# EasyEDA Pro project RP2350.epro

# Schematic RP2350
Board Name: RP2350; Create Date: 2025-02-19; Page Name: RP2350; Project Name: ESP32 - RP2350; Schematic Name: RP2350; Update Date: 2025-02-19; Company: EasyEDA.com; Drawn: David Knell; Page Size: A4; Version: V1.0
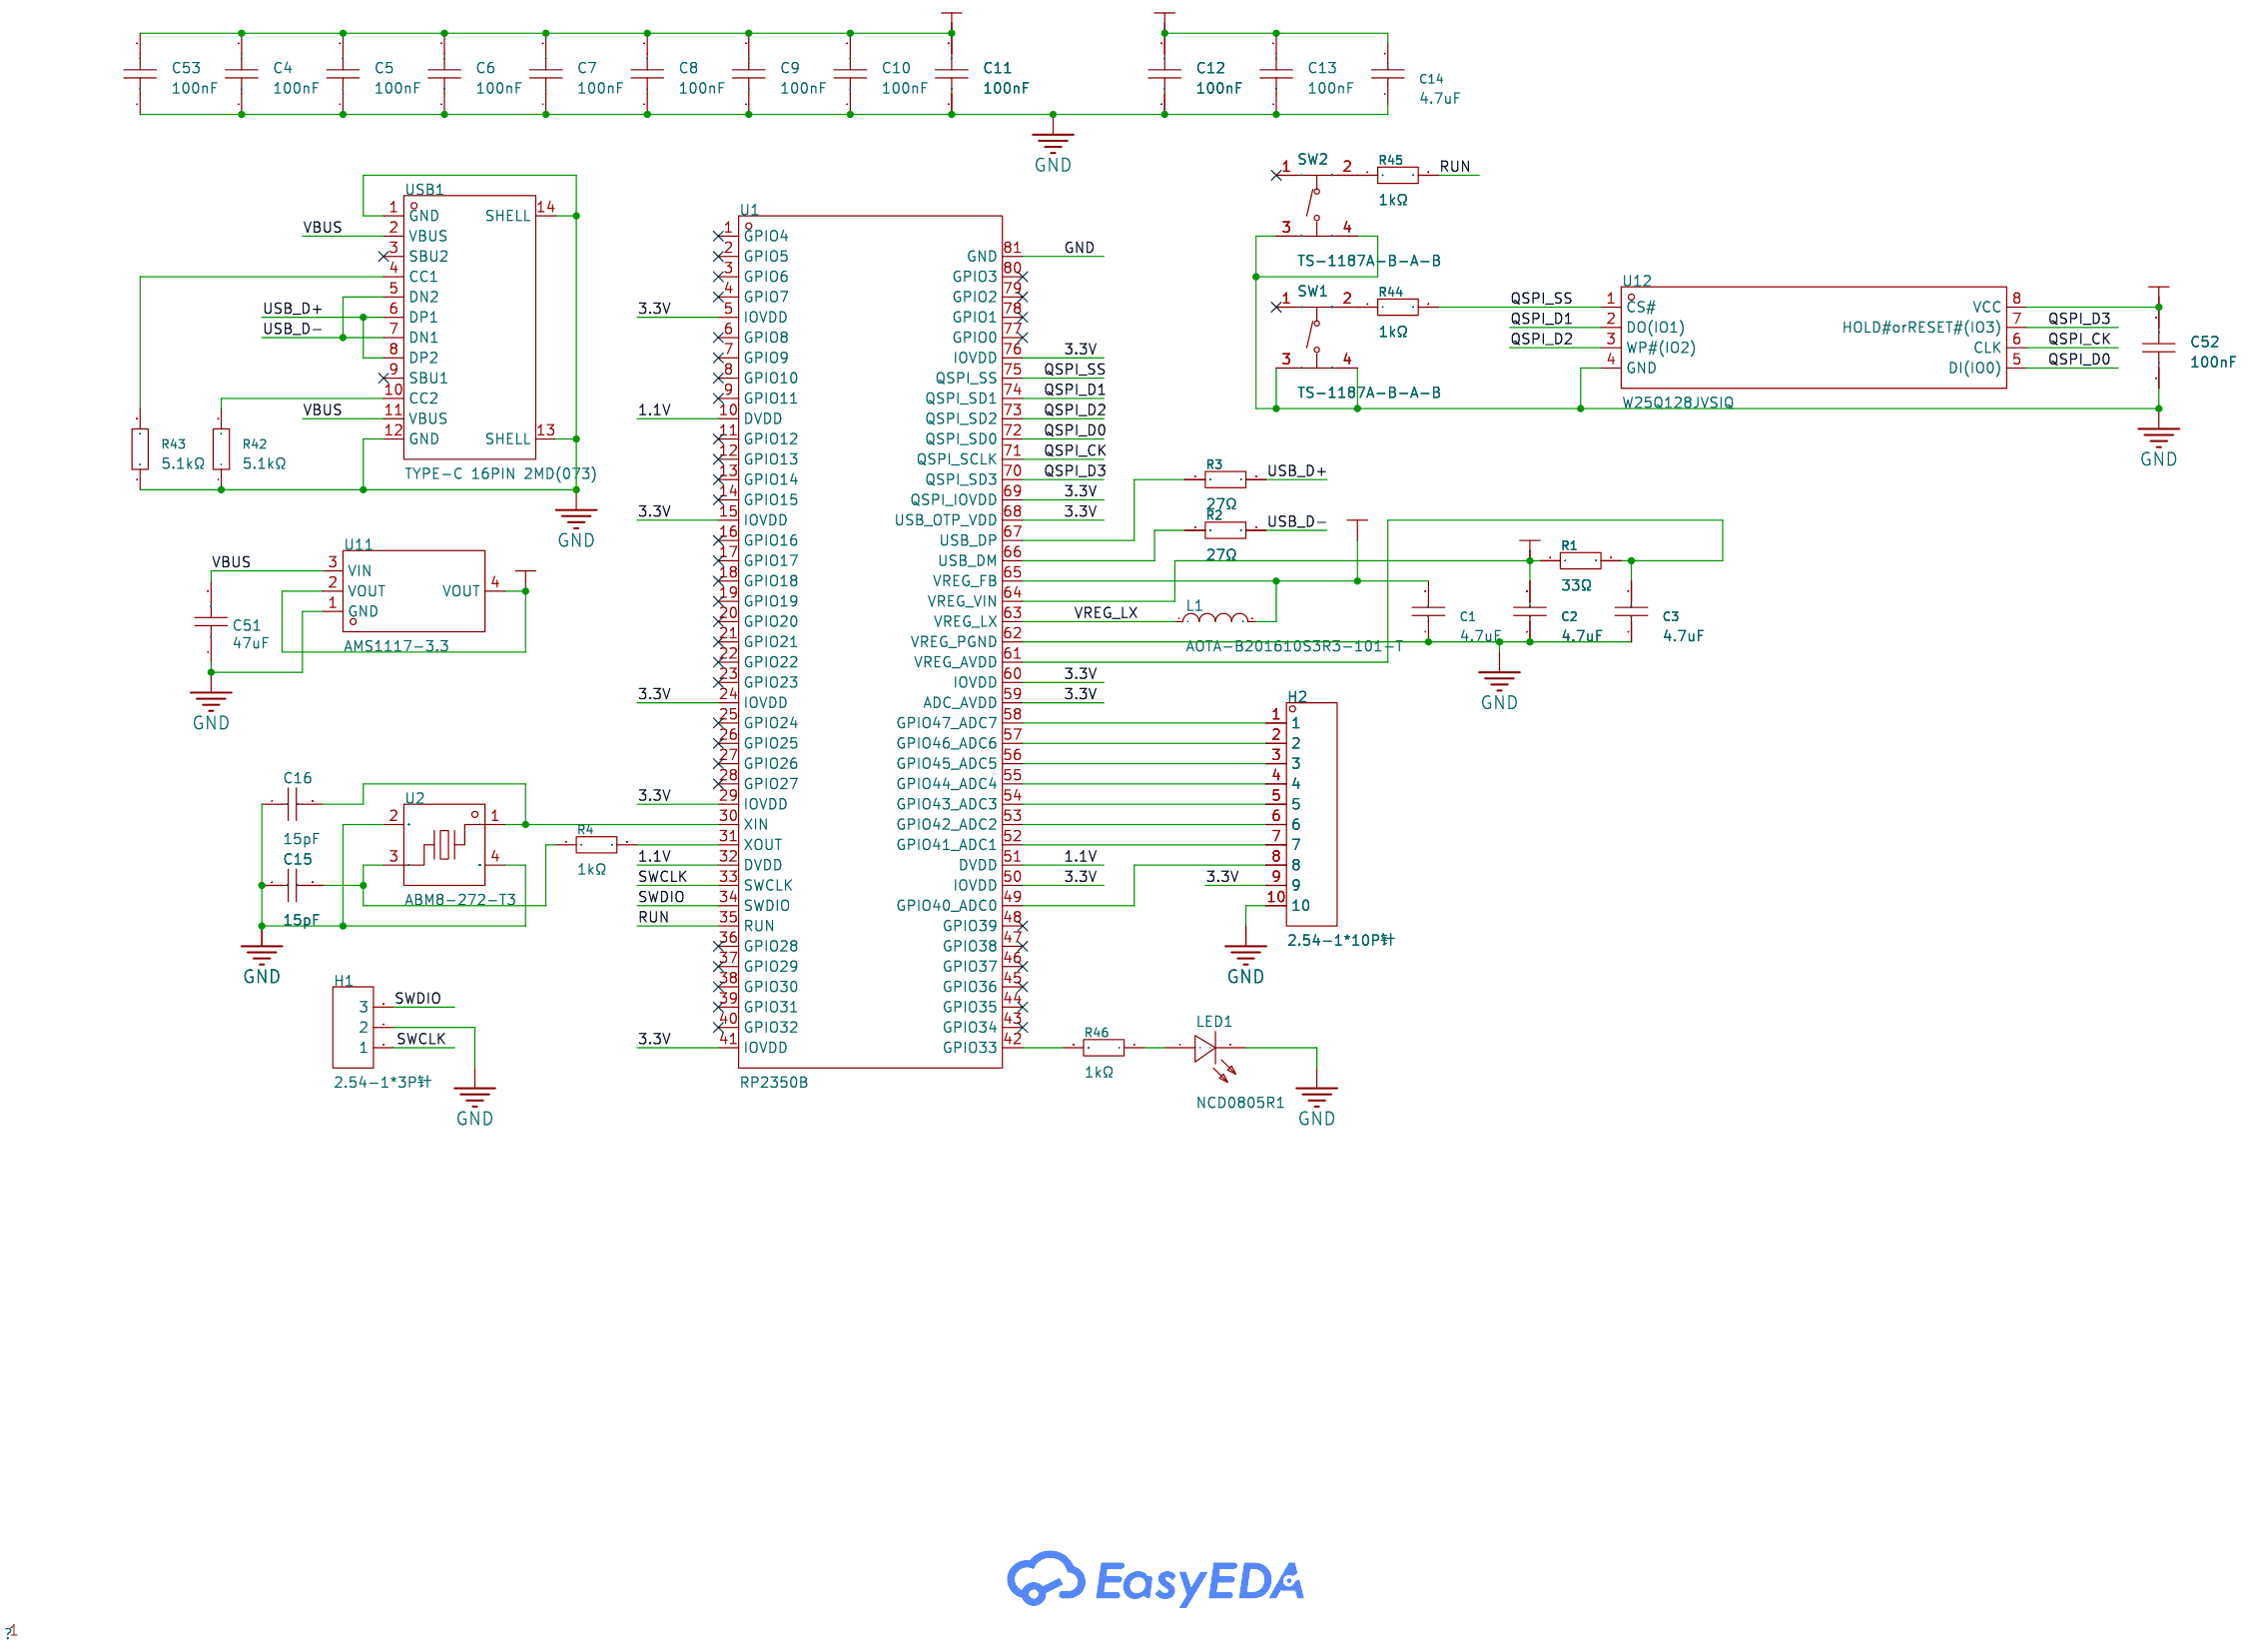
[diagram p0: schematic sheet]

## Parts
C1  4.7uF  [0402-MIN]
C2  4.7uF  [0402-MIN]
C3  4.7uF  [0402-MIN]
C4  100nF  [0402-MIN]
C5  100nF  [0402-MIN]
C6  100nF  [0402-MIN]
C7  100nF  [0402-MIN]
C8  100nF  [0402-MIN]
C9  100nF  [0402-MIN]
C10  100nF  [0402-MIN]
C11  100nF  [0402-MIN]
C12  100nF  [0402-MIN]
C13  100nF  [0402-MIN]
C14  4.7uF  [0402-MIN]
C15  15pF  [C0402]
C16  15pF  [C0402]
C51  47uF  [C1206]
C52  100nF  [0402-MIN]
C53  100nF  [0402-MIN]
H1  2.54-1*3P针  [HDR-TH_3P-P2.54-V-M-1]
H2  2.54-1*10P针  [HDR-TH_10P-P2.54-V-M-1]
L1  AOTA-B201610S3R3-101-T  [IND-SMD_L2.0-W1.6_AOTA-B201610S3R3-101-T]
LED1  NCD0805R1  [LED0805-R-RD]
R1  33Ω  [0402-MIN]
R2  27Ω  [R0402]
R3  27Ω  [R0402]
R4  1kΩ  [R0402]
R42  5.1kΩ  [R0402]
R43  5.1kΩ  [R0402]
R44  1kΩ  [R0402]
R45  1kΩ  [R0402]
R46  1kΩ  [R0402]
SW1  TS-1187A-B-A-B  [SW-SMD_4P-L5.1-W5.1-P3.70-LS6.5-TL_H1.5]
SW2  TS-1187A-B-A-B  [SW-SMD_4P-L5.1-W5.1-P3.70-LS6.5-TL_H1.5]
U1  RP2350B  [QFN-80_L10.0-W10.0-P0.40-TL-EP3.4]
U2  ABM8-272-T3  [CRYSTAL-SMD_4P-L3.2-W2.5-BL]
U11  AMS1117-3.3  [SOT-223-3_L6.5-W3.4-P2.30-LS7.0-BR]
U12  W25Q128JVSIQ  [SOIC-8_L5.3-W5.3-P1.27-LS8.0-BL]
USB1  TYPE-C 16PIN 2MD(073)  [USB-C-SMD_TYPE-C-6PIN-2MD-073]

## Library data of the parts
C1-C3 C14 = CL05A475MP5NRNC: Capacitance: Tolerance:±20% Tolerance:±20% Voltage Rated: Temperature Coefficient:; LCSC Part Name: 4.7uF ±20% 10V; Supplier Part: C23733; Manufacturer: SAMSUNG(三星); Supplier Footprint: 0402; JLCPCB Part Class: Basic Part; Datasheet: https://atta.szlcsc.com/upload/public/pdf/source/20160218/1457707763339.pdf; Supplier: LCSC; Tolerance: ±20%
C4-C13 C52 C53 = CL05B104KO5NNNC: Capacitance: Tolerance:±10% Tolerance:±10% Voltage Rated: Temperature Coefficient:; LCSC Part Name: 100nF ±10% 16V; Supplier Part: C1525; Manufacturer: SAMSUNG(三星); Supplier Footprint: 0402; JLCPCB Part Class: Basic Part; Datasheet: https://atta.szlcsc.com/upload/public/pdf/source/20160218/1457707763339.pdf; Supplier: LCSC; Tolerance: ±10%
C15 C16 = 0402CG150J500NT: Capacitance: Tolerance:±5% Tolerance:±5% Voltage Rated: Temperature Coefficient:; LCSC Part Name: 15pF ±5% 50V; Supplier Part: C1548; Manufacturer: FH(风华); Supplier Footprint: 0402; JLCPCB Part Class: Basic Part; Datasheet: https://atta.szlcsc.com/upload/public/pdf/source/20200305/C486355_26A10D38EF8C2A5C37091D0039909270.pdf; Supplier: LCSC; Tolerance: ±5%
C51 = 47uF: Supplier: LCSC; Manufacturer: SAMSUNG; Manufacturer Part: CL31A476MPHNNNE; Supplier Part: C96123; JLCPCB Part Class: Basic; JLCPCB SMD: Yes
H1 = 2.54-1*3P针: Pin Structure:1x3P Pitch:2.54mm Row Spacing:- Circluar Pins/Square Pins:Policy Mounting Type:Direct Insert Number of Rows:Single Row Number of Pins:3P Current Rating (Max):3A Voltage Rating (Max):- Length of Mating Pin:- Insulation Height:- Length of End; LCSC Part Name: 间距:2.54mm 1x3P 直插 方针; Supplier Part: C49257; Manufacturer: BOOMELE(博穆精密); Supplier Footprint: 插件,P=2.54mm; JLCPCB Part Class: Extended Part; Datasheet: https://atta.szlcsc.com/upload/public/pdf/source/20221018/3E9408392E35E6F57A28985E5F7BF5C9.pdf; Supplier: LCSC; Pin Structure: 1x3P; Pitch: 2.54mm; Circluar Pins/Square Pins: Policy; Mounting Type: Direct Insert; Number of Rows: Single Row; Number of Pins: 3P; Current Rating (Max): 3A; Operating Temperature Range: -40℃~+105℃; Color: Black
H2 = 2.54-1*10P针: Pin Structure:1x10P Pitch:2.54mm Row Spacing:- Circluar Pins/Square Pins:Square Pins Mounting Type:Straight Number of Rows:Plugin Number of Pins:10P Current Rating (Max):3A Voltage Rating (Max):- Length of Mating Pin:- Insulation Height:- Length of End Co; LCSC Part Name: 间距:2.54mm 1x10P 直插 方针; Supplier Part: C57369; Manufacturer: BOOMELE(博穆精密); Supplier Footprint: 插件,P=2.54mm; JLCPCB Part Class: Extended Part; Datasheet: https://atta.szlcsc.com/upload/public/pdf/source/20151109/1457707572883.pdf; Supplier: LCSC; Pin Structure: 1x10P; Pitch: 2.54mm; Circluar Pins/Square Pins: Square Pins; Mounting Type: Straight; Number of Rows: Plugin; Number of Pins: 10P; Current Rating (Max): 3A; Operating Temperature Range: -40℃~+105℃; Color: Black
L1 = AOTA-B201610S3R3-101-T: Supplier Part: C42411119; Manufacturer: ABRACON; Supplier Footprint: 0806; JLCPCB Part Class: Extended Part; Datasheet: https://atta.szlcsc.com/upload/public/pdf/source/20241210/8ED7235334351200B2CE75E3CBC0DAAD.pdf; Supplier: LCSC
LED1 = NCD0805R1_C84256: Lamp Holder Type:- Emitted Color:Red Forward Voltage (VF):1.6V~2.6V Forward Voltage (VF):1.6V~2.6V Power Dissipation:65mW Forward Current:20mA Dominant Wavelength:615nm~630nm Dominant Wavelength:615nm~630nm Peak Wavelength:- Diode Configuration:独立二极管 Lens; Supplier Part: C84256; Manufacturer: 国星光电; Supplier Footprint: 0805; JLCPCB Part Class: Basic Part; Datasheet: https://atta.szlcsc.com/upload/public/pdf/source/20200820/C84256_F0A75A43B3EAD75808600A0514C76B99.pdf; Supplier: LCSC; Emitted Color: Red; Forward Voltage (VF): 1.6V~2.6V; Power Dissipation: 65mW; Forward Current: 20mA; Dominant Wavelength: 615nm~630nm; Diode Configuration: 独立二极管; Lens Color: 无色透明透镜; Luminous Intensity: 67mcd~195mcd; Viewing Angle: 130°; Operating Temperature: -30℃~+85℃
R1 = 0402WGF330JTCE: Type:Thick Film Resistors Resistance:33Ω Tolerance:±1% Tolerance:±1% Power(Watts): Overload Voltage (Max): Temperature Coefficient:±100ppm/℃ Temperature Coefficient:±100ppm/℃ Operating Temperature Range:-55℃~+155℃ Operating Temperature Range:-55℃~+155℃; LCSC Part Name: 33Ω ±1% 62.5mW 厚膜电阻; Supplier Part: C25105; Manufacturer: UNI-ROYAL(厚声); Supplier Footprint: 0402; JLCPCB Part Class: Basic Part; Datasheet: https://atta.szlcsc.com/upload/public/pdf/source/20200306/C422600_1E6D84923E4A46A82E41ADD87F860B5C.pdf; Supplier: LCSC; Type: Thick Film Resistors; Tolerance: ±1%; Temperature Coefficient: ±100ppm/℃; Operating Temperature Range: -55℃~+155℃
R2 = 0402WGF270JTCE: Type:Thick Film Resistors Resistance:27Ω Tolerance:±1% Tolerance:±1% Power(Watts): Overload Voltage (Max): Temperature Coefficient:±100ppm/℃ Temperature Coefficient:±100ppm/℃ Operating Temperature Range:-55℃~+155℃ Operating Temperature Range:-55℃~+155℃; LCSC Part Name: 27Ω ±1% 62.5mW 厚膜电阻; Supplier Part: C25100; Manufacturer: UNI-ROYAL(厚声); Supplier Footprint: 0402; JLCPCB Part Class: Extended Part; Datasheet: https://atta.szlcsc.com/upload/public/pdf/source/20200306/C422600_1E6D84923E4A46A82E41ADD87F860B5C.pdf; Supplier: LCSC; Type: Thick Film Resistors; Tolerance: ±1%; Temperature Coefficient: ±100ppm/℃; Operating Temperature Range: -55℃~+155℃
R3 = 0402WGF270JTCE: Type:Thick Film Resistors Resistance:27Ω Tolerance:±1% Tolerance:±1% Power(Watts): Overload Voltage (Max): Temperature Coefficient:±100ppm/℃ Temperature Coefficient:±100ppm/℃ Operating Temperature Range:-55℃~+155℃ Operating Temperature Range:-55℃~+155℃; LCSC Part Name: 27Ω ±1% 62.5mW 厚膜电阻; Supplier Part: C25100; Manufacturer: UNI-ROYAL(厚声); Manufacturer Part: F; Supplier Footprint: 0402; JLCPCB Part Class: Extended Part; Datasheet: https://atta.szlcsc.com/upload/public/pdf/source/20200306/C422600_1E6D84923E4A46A82E41ADD87F860B5C.pdf; Supplier: LCSC; Type: Thick Film Resistors; Tolerance: ±1%; Temperature Coefficient: ±100ppm/℃; Operating Temperature Range: -55℃~+155℃
R4 R44-R46 = 0402WGF1001TCE: Type:Thick Film Resistors Resistance:1kΩ Tolerance:±1% Tolerance:±1% Power(Watts): Overload Voltage (Max): Temperature Coefficient:±100ppm/℃ Temperature Coefficient:±100ppm/℃ Operating Temperature Range:-55℃~+155℃ Operating Temperature Range:-55℃~+155℃; LCSC Part Name: 1kΩ ±1% 62.5mW 厚膜电阻; Supplier Part: C11702; Manufacturer: UNI-ROYAL(厚声); Supplier Footprint: 0402; JLCPCB Part Class: Basic Part; Datasheet: https://atta.szlcsc.com/upload/public/pdf/source/20200306/C422600_1E6D84923E4A46A82E41ADD87F860B5C.pdf; Supplier: LCSC; Type: Thick Film Resistors; Tolerance: ±1%; Temperature Coefficient: ±100ppm/℃; Operating Temperature Range: -55℃~+155℃
R42 R43 = 0402WGF5101TCE: Type:Thick Film Resistors Resistance:5.1kΩ Tolerance:±1% Tolerance:±1% Power(Watts): Overload Voltage (Max): Temperature Coefficient:±100ppm/℃ Temperature Coefficient:±100ppm/℃ Operating Temperature Range:-55℃~+155℃ Operating Temperature Range:-55℃~+155℃; LCSC Part Name: 5.1kΩ ±1% 62.5mW 厚膜电阻; Supplier Part: C25905; Manufacturer: UNI-ROYAL(厚声); Supplier Footprint: 0402; JLCPCB Part Class: Basic Part; Datasheet: https://atta.szlcsc.com/upload/public/pdf/source/20200306/C422600_1E6D84923E4A46A82E41ADD87F860B5C.pdf; Supplier: LCSC; Type: Thick Film Resistors; Tolerance: ±1%; Temperature Coefficient: ±100ppm/℃; Operating Temperature Range: -55℃~+155℃
SW1 SW2 = TS-1187A-B-A-B: Circuit:SPST Actuator Style:Round Button Operating Force:160gf Mounting Style:Brick nogging Switch Length:5.1mm Switch Width:5.1mm Switch Height:1.5mm Strike Gundam:不带 Contact Current:50mA Voltage Rating (DC):12V Insulation Resistance:- Actuator/Cap Color; LCSC Part Name: 5.1*5.1*1.5mm 立贴 轻触开关; Supplier Part: C318884; Manufacturer: XKB Connectivity(中国星坤); Supplier Footprint: SMD; JLCPCB Part Class: Basic Part; Datasheet: https://atta.szlcsc.com/upload/public/pdf/source/20200227/C318890_053E50208A88A7BA1965D8746000774E.pdf; Supplier: LCSC; Circuit: SPST; Actuator Style: Round Button; Operating Force: 160gf; Mounting Style: Brick nogging; Switch Length: 5.1mm; Switch Width: 5.1mm; Switch Height: 1.5mm; Strike Gundam: 不带; Contact Current: 50mA; Voltage Rating (DC): 12V; Actuator/Cap Color: 金色; With Lamp: No; Mechanical Life: 10万次; Operating Temperature: -30℃~+85℃
U1 = RP2350B_C42415655: Supplier Part: C42415655; Manufacturer: Raspberry Pi(树莓派); Supplier Footprint: QFN-80-EP(10x10); JLCPCB Part Class: Extended Part; Datasheet: https://atta.szlcsc.com/upload/public/pdf/source/20241210/0989AB86AAD7A21936E5CD12ADC9EA29.pdf; Supplier: LCSC
U2 = ABM8-272-T3_C20625731: Supplier Part: C20625731; Manufacturer: ABRACON; Supplier Footprint: SMD3225-4P; JLCPCB Part Class: Extended Part; Datasheet: https://atta.szlcsc.com/upload/public/pdf/source/20240227/A8BE43F636D80F75C9AF5C59EDF21E9A.pdf; Supplier: LCSC
U11 = AMS1117-3.3_C6186: Output Type: Maximum Input Voltage:- Output Voltage:3.3V Output Voltage:3.3V MAX Output Current:1A Power Supply Rejection Ratio (PSRR):72dB@(120Hz) Dropout Voltage:1.3V@(800mA) standby current:- Noise:- Feature:- Operating Temperature:- Operating Temperat; LCSC Part Name: 输出3.3V 1A; Supplier Part: C6186; Manufacturer: AMS; Supplier Footprint: SOT-223; JLCPCB Part Class: Basic Part; Datasheet: https://atta.szlcsc.com/upload/public/pdf/source/20180727/C6186_7A095716F0823C02F1997A905E26C086.pdf; Supplier: LCSC; Output Voltage: 3.3V; MAX Output Current: 1A; Power Supply Rejection Ratio (PSRR): 72dB@(120Hz); Dropout Voltage: 1.3V@(800mA); Output Polarity: Positive electrode; Number of Outputs: 1
U12 = W25Q128JVSIQ_C113767: Interface:SPI Memory Size:128Mbit Voltage - Supply:2.7V~3.6V Voltage - Supply:2.7V~3.6V Page Programming Time (Tpp):3ms Operating Temperature:-40℃~+85℃ Operating Temperature:-40℃~+85℃; Supplier Part: C113767; Manufacturer: WINBOND(华邦); Supplier Footprint: SOIC-8-208mil; JLCPCB Part Class: Extended Part; Datasheet: https://atta.szlcsc.com/upload/public/pdf/source/20180329/C113767_097B64D788F6E3FFB2E9CB46CB6C1427.pdf; Supplier: LCSC; Interface: SPI; Memory Size: 128Mbit; Voltage - Supply: 2.7V~3.6V; Page Programming Time (Tpp): 3ms; Operating Temperature: -40℃~+85℃
USB1 = TYPE-C 16PIN 2MD(073): Connector Type:Type-C Standard:USB 3.1 Gender:Female Mounting Style:Horizontal attachment Number of Contacts:16P Number of Ports:1 Current Rating - Power (Max):5A Operating Temperature Range:-25℃~+85℃ Operating Temperature Range:-25℃~+85℃ Rated Voltage (M; LCSC Part Name: Type-C 母 卧贴; Supplier Part: C2765186; Manufacturer: SHOU HAN(首韩); Supplier Footprint: SMD; JLCPCB Part Class: Extended Part; Datasheet: https://atta.szlcsc.com/upload/public/pdf/source/20211123/39B17C16241EAC15C5E277BDA434118E.pdf; Supplier: LCSC; Connector Type: Type-C; Standard: USB 3.1; Gender: Female; Mounting Style: Horizontal attachment; Number of Contacts: 16P; Number of Ports: 1; Current Rating - Power (Max): 5A; Operating Temperature Range: -25℃~+85℃; Rated Voltage (Max): 5V; Connect-Disconnect Life: 5000 Cuts; Core Colour: Black

## Nets
1.1V: C1.2 C12.2 C13.2 C14.2 L1.2 U1.10(DVDD) U1.32(DVDD) U1.51(DVDD) U1.65(VREG_FB)
3.3V: C2.2 C4.2 C5.2 C6.2 C7.2 C8.2 C9.2 C10.2 C11.2 C52.2 C53.2 H2.9 R1.1 U1.5(IOVDD) U1.15(IOVDD) U1.24(IOVDD) U1.29(IOVDD) U1.41(IOVDD) U1.50(IOVDD) U1.59(ADC_AVDD) U1.60(IOVDD) U1.64(VREG_VIN) U1.68(USB_OTP_VDD) U1.69(QSPI_IOVDD) U1.76(IOVDD) U11.2(VOUT) U11.4(VOUT) U12.8(VCC)
GND: C1.1 C2.1 C3.1 C4.1 C5.1 C6.1 C7.1 C8.1 C9.1 C10.1 C11.1 C12.1 C13.1 C14.1 C15.1 C16.1 C51.1 C52.1 C53.1 H1.2 H2.10 LED1.2(-) R42.1 R43.1 SW1.3(C) SW1.4(D) SW2.3(C) SW2.4(D) U1.62(VREG_PGND) U1.81(GND) U2.2(GND) U2.4(GND) U11.1(GND) U12.4(GND) USB1.1(GND) USB1.12(GND) USB1.13(SHELL) USB1.14(SHELL)
VBUS: C51.2 U11.3(VIN) USB1.2(VBUS) USB1.11(VBUS)
QSPI_CK: U1.71(QSPI_SCLK) U12.6(CLK)
QSPI_D0: U1.72(QSPI_SD0) U12.5(DI(IO0))
QSPI_D1: U1.74(QSPI_SD1) U12.2(DO(IO1))
QSPI_D2: U1.73(QSPI_SD2) U12.3(WP#(IO2))
QSPI_D3: U1.70(QSPI_SD3) U12.7(HOLD#orRESET#(IO3))
QSPI_SS: R44.2 U1.75(QSPI_SS) U12.1(CS#)
RUN: R45.2 U1.35(RUN)
SWCLK: H1.1 U1.33(SWCLK)
SWDIO: H1.3 U1.34(SWDIO)
USB_D+: R3.2 USB1.6(DP1) USB1.8(DP2)
USB_D-: R2.2 USB1.5(DN2) USB1.7(DN1)
VREG_LX: L1.1 U1.63(VREG_LX)
$2N709: C3.2 R1.2 U1.61(VREG_AVDD)
$2N1372: R2.1 U1.66(USB_DM)
$2N1378: R3.1 U1.67(USB_DP)
$2N1715: C15.2 R4.1 U2.3
$2N1721: C16.2 U1.30(XIN) U2.1
$2N1841: R4.2 U1.31(XOUT)
$2N2034: R43.2 USB1.4(CC1)
$2N2035: R42.2 USB1.10(CC2)
$2N2585: R44.1 SW1.2(B)
$2N2753: R45.1 SW2.2(B)
$2N2964: R46.2 U1.42(GPIO33)
$2N3014: LED1.1(+) R46.1
$2N3106: H2.1 U1.58(GPIO47_ADC7)
$2N3110: H2.2 U1.57(GPIO46_ADC6)
$2N3115: H2.3 U1.56(GPIO45_ADC5)
$2N3120: H2.4 U1.55(GPIO44_ADC4)
$2N3125: H2.5 U1.54(GPIO43_ADC3)
$2N3130: H2.6 U1.53(GPIO42_ADC2)
$2N3135: H2.7 U1.52(GPIO41_ADC1)
$2N3140: H2.8 U1.49(GPIO40_ADC0)

Not connected (* = marked no-connect by the designer): SW1 1(A)*; SW2 1(A)*; U1 1(GPIO4)* 2(GPIO5)* 3(GPIO6)* 4(GPIO7)* 6(GPIO8)* 7(GPIO9)* 8(GPIO10)* 9(GPIO11)* 11(GPIO12)* 12(GPIO13)* 13(GPIO14)* 14(GPIO15)* 16(GPIO16)* 17(GPIO17)* 18(GPIO18)* 19(GPIO19)* 20(GPIO20)* 21(GPIO21)* 22(GPIO22)* 23(GPIO23)* 25(GPIO24)* 26(GPIO25)* 27(GPIO26)* 28(GPIO27)* 36(GPIO28)* 37(GPIO29)* 38(GPIO30)* 39(GPIO31)* 40(GPIO32)* 43(GPIO34)* 44(GPIO35)* 45(GPIO36)* 46(GPIO37)* 47(GPIO38)* 48(GPIO39)* 77(GPIO0)* 78(GPIO1)* 79(GPIO2)* 80(GPIO3)*; USB1 3(SBU2)* 9(SBU1)*

# Board RP2350
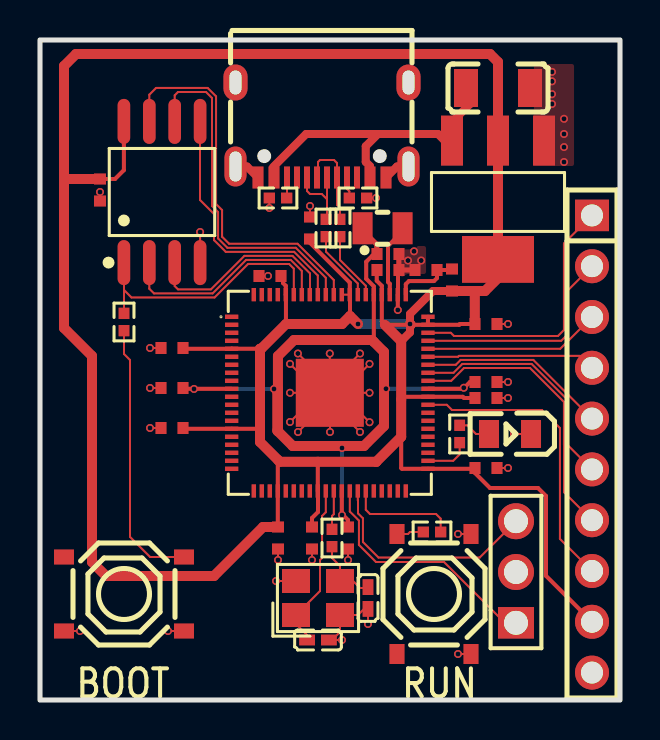
[diagram p1: board, top side]
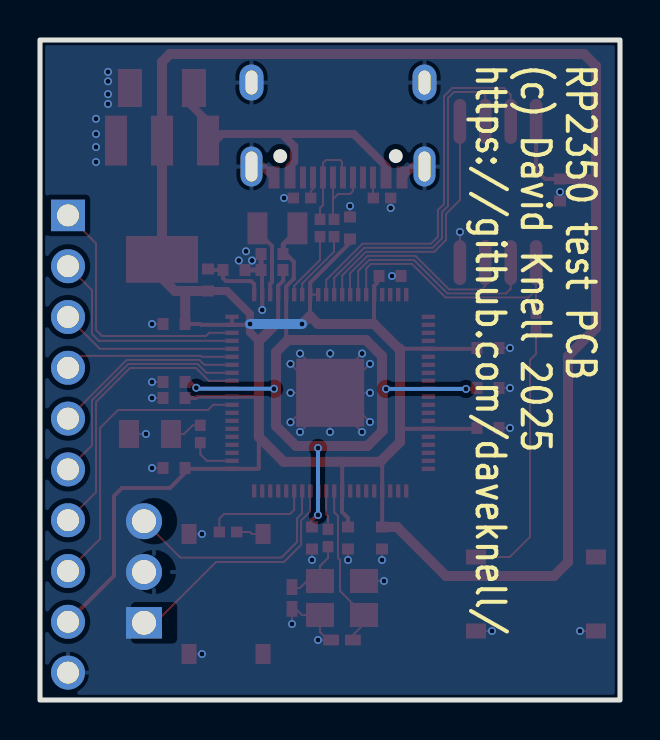
[diagram p2: board, bottom side, seen from below]

Outline 29 x 33 mm; copper layers: Top Layer, Bottom Layer. Coordinates in mm from the lower left corner of the outline.
Outline path: rectangle 0,33 29,0
Stack: Top Layer 0.035mm / Dielectric1 1.51mm FR4 er 4.5 / Bottom Layer 0.035mm

## Design rules (mm)
template: Custom Config
spacing copperThickness1oz (default): track to track 0.102, other pairs 0.152 to 0.3
spacing copperThickness2oz: track to track 0.203, other pairs 0.152 to 0.3
track width copperThickness1oz (default): min 0.1, default 0.1, max 2.54
track width copperThickness2oz: min 0.203, default 0.254, max 2.54
differential pair differentialPair (default): width min 0.127, default 0.254, max 2.54; gap min 0.152, default 0.152
via viaSize (default): diameter min 0.4, default 0.4, max 10; hole min 0.25, default 0.25, max 6.3

## Placement (name value [footprint] x y rotation side)
C1  4.7uF  [0402-MIN]  17.4 22.3 180 top
C2  4.7uF  [0402-MIN]  17.4 21.5 180 top
C3  4.7uF  [0402-MIN]  19.3 21.5 0 top
C4  100nF  [0402-MIN]  11.9 8.1 90 top
C5  100nF  [0402-MIN]  13.6 8.1 90 top
C6  100nF  [0402-MIN]  6.6 13.6 0 top
C7  100nF  [0402-MIN]  6.6 17.6 0 top
C8  100nF  [0402-MIN]  22.3 11.6 180 top
C9  100nF  [0402-MIN]  22.3 15.1 180 top
C10  100nF  [0402-MIN]  11.5 21.2 0 top
C11  100nF  [0402-MIN]  22.3 18.8 180 top
C12  100nF  [0402-MIN]  6.6 15.6 0 top
C13  100nF  [0402-MIN]  22.3 15.9 180 top
C14  4.7uF  [0402-MIN]  15.4 8.1 90 top
C15  15pF  [C0402]  16.4 5.1 90 top
C16  15pF  [C0402]  13.9 3 180 top
C51  47uF  [C1206]  22.9 30.6 180 top
C52  100nF  [0402-MIN]  3 25.5 90 top
C53  100nF  [0402-MIN]  13.5 23.6 270 top
H1  2.54-1*3P针  [HDR-TH_3P-P2.54-V-M-1]  23.8 6.4 90 top
H2  2.54-1*10P针  [HDR-TH_10P-P2.54-V-M-1]  27.6 12.8 270 top
L1  AOTA-B201610S3R3-101-T  [IND-SMD_L2.0-W1.6_AOTA-B201610S3R3-101-T]  17.13 23.59 180 top
LED1  NCD0805R1  [LED0805-R-RD]  23.5 13.3 180 top
R1  33Ω  [0402-MIN]  20.6 21 90 top
R2  27Ω  [R0402]  15 23.6 90 top
R3  27Ω  [R0402]  14.3 23.6 90 top
R4  1kΩ  [R0402]  14.6 8.1 90 top
R42  5.1kΩ  [R0402]  11.9 25.1 0 top
R43  5.1kΩ  [R0402]  15.9 25.1 180 top
R44  1kΩ  [R0402]  4.2 18.9 90 top
R45  1kΩ  [R0402]  19.6 8.4 0 top
R46  1kΩ  [R0402]  20.98 13.3 270 top
SW1  TS-1187A-B-A-B  [SW-SMD_4P-L5.1-W5.1-P3.70-LS6.5-TL_H1.5]  4.2 5.3 0 top
SW2  TS-1187A-B-A-B  [SW-SMD_4P-L5.1-W5.1-P3.70-LS6.5-TL_H1.5]  19.7 5.3 90 top
U1  RP2350B  [QFN-80_L10.0-W10.0-P0.40-TL-EP3.4]  14.49 15.36 0 top
U2  ABM8-272-T3  [CRYSTAL-SMD_4P-L3.2-W2.5-BL]  13.9 5.1 0 top
U11  AMS1117-3.3  [SOT-223-3_L6.5-W3.4-P2.30-LS7.0-BR]  22.9 25 90 top
U12  W25Q128JVSIQ  [SOIC-8_L5.3-W5.3-P1.27-LS8.0-BL]  6.1 25.4 0 top
USB1  TYPE-C 16PIN 2MD(073)  [USB-C-SMD_TYPE-C-6PIN-2MD-073]  14.1 28.5 180 top

## Footprints (pads in the part's own frame, mm; a bottom-side part is the same pattern mirrored in y, then rotated)
0402-MIN
  rect 0.55x0.6 smd: 1(-0.55,0) 2(0.55,0)
C0402
  rect 0.79x0.54 smd: 1(-0.545,0) 2(0.545,0)
C1206
  rect 1.2x1.9 smd: 1(-1.6,0) 2(1.6,0)
CRYSTAL-SMD_4P-L3.2-W2.5-BL
  rect 1.4x1.2 smd: 1(-1.1,-0.85) 2(1.1,-0.85) 3(1.1,0.85) 4(-1.1,0.85)
HDR-TH_3P-P2.54-V-M-1
  rect 1.575x1.8 hole 1.2: 1(-2.54,0)
  round 1.8 hole 1.2: 2(0,0) 3(2.54,0)
HDR-TH_10P-P2.54-V-M-1
  rect 1.575x1.7 hole 1.1: 1(-11.43,0)
  round 1.7 hole 1.1: 2(-8.89,0) 3(-6.35,0) 4(-3.81,0) 5(-1.27,0) 6(1.27,0) 7(3.81,0) 8(6.35,0) 9(8.89,0) 10(11.43,0)
IND-SMD_L2.0-W1.6_AOTA-B201610S3R3-101-T
  rect 1x1.6 smd: 1(-1,0) 2(1,0)
LED0805-R-RD
  rect 1x1.399 smd: 1(1.05,0) 2(-1.05,0)
QFN-80_L10.0-W10.0-P0.40-TL-EP3.4
  rect 0.665x0.22 smd: 1(-4.907,3.8) 2(-4.907,3.4) 3(-4.907,3) 4(-4.907,2.6) 5(-4.907,2.2) 6(-4.907,1.8) 7(-4.907,1.4) 8(-4.907,1) 9(-4.907,0.6) 10(-4.907,0.2) 11(-4.907,-0.2) 12(-4.907,-0.6) 13(-4.907,-1) 14(-4.907,-1.4) 15(-4.907,-1.8) 16(-4.907,-2.2) 17(-4.907,-2.6) 18(-4.907,-3) 19(-4.907,-3.4) 20(-4.907,-3.8) 41(4.907,-3.8) 42(4.907,-3.4) 43(4.907,-3) 44(4.907,-2.6) 45(4.907,-2.2) 46(4.907,-1.8) 47(4.907,-1.4) 48(4.907,-1) 49(4.907,-0.6) 50(4.907,-0.2) 51(4.907,0.2) 52(4.907,0.6) 53(4.907,1) 54(4.907,1.4) 55(4.907,1.8) 56(4.907,2.2) 57(4.907,2.6) 58(4.907,3) 59(4.907,3.4) 60(4.907,3.8)
  rect 0.22x0.665 smd: 21(-3.8,-4.907) 22(-3.4,-4.907) 23(-3,-4.907) 24(-2.6,-4.907) 25(-2.2,-4.907) 26(-1.8,-4.907) 27(-1.4,-4.907) 28(-1,-4.907) 29(-0.6,-4.907) 30(-0.2,-4.907) 31(0.2,-4.907) 32(0.6,-4.907) 33(1,-4.907) 34(1.4,-4.907) 35(1.8,-4.907) 36(2.2,-4.907) 37(2.6,-4.907) 38(3,-4.907) 39(3.4,-4.907) 40(3.8,-4.907) 61(3.8,4.907) 62(3.4,4.907) 63(3,4.907) 64(2.6,4.907) 65(2.2,4.907) 66(1.8,4.907) 67(1.4,4.907) 68(1,4.907) 69(0.6,4.907) 70(0.2,4.907) 71(-0.2,4.907) 72(-0.6,4.907) 73(-1,4.907) 74(-1.4,4.907) 75(-1.8,4.907) 76(-2.2,4.907) 77(-2.6,4.907) 78(-3,4.907) 79(-3.4,4.907) 80(-3.8,4.907)
  rect 3.4x3.4 smd: 81(0,0)
R0402
  rect 0.566x0.54 smd: 1(-0.433,0) 2(0.433,0)
SOIC-8_L5.3-W5.3-P1.27-LS8.0-BL
  oval 0.63x2.25 smd: 1(-1.905,-3.53) 2(-0.635,-3.53) 3(0.635,-3.53) 4(1.905,-3.53) 5(1.905,3.53) 6(0.635,3.53) 7(-0.635,3.53) 8(-1.905,3.53)
SOT-223-3_L6.5-W3.4-P2.30-LS7.0-BR
  rect 2.5x1.1 smd: 1(2.97,-2.3) 2(2.97,0) 3(2.97,2.3)
  rect 2.34x3.6 smd: 4(-2.97,0)
SW-SMD_4P-L5.1-W5.1-P3.70-LS6.5-TL_H1.5
  rect 1x0.75 smd: 1(-3,1.85) 2(3,1.85) 3(-3,-1.85) 4(3,-1.85)
USB-C-SMD_TYPE-C-6PIN-2MD-073
  rect 0.55x1.1 smd: 1(-3.2,2.375) 2(-2.4,2.375) 11(2.4,2.375) 12(3.2,2.375)
  rect 0.3x1.1 smd: 3(-1.75,2.375) 4(-1.25,2.375) 5(-0.75,2.375) 6(-0.25,2.375) 7(0.25,2.375) 8(0.75,2.375) 9(1.25,2.375) 10(1.75,2.375)
  oval 1.1x2 hole 0.6x1.5: 13(-4.325,1.825) 14(4.325,1.825)
  oval 1.2x1.8 hole 0.6x1.2: 13(-4.325,-2.375) 14(4.325,-2.375)

## Nets
As in the schematic.

Pads without a net: SW1 1; SW2 1; U1 1 2 3 4 6 7 8 9 11 12 13 14 16 17 18 19 20 21 22 23 25 26 27 28 36 37 38 39 40 43 44 45 46 47 48 77 78 79 80; USB1 3 9

## Via types
v1: diameter 0.4, hole 0.25, Top Layer to Bottom Layer, 56 vias

## Routing (per net, layer and track width the routed paths; a pad name or vN(x,y) marks a point on that pad's centre or on a via; arc(x,y) is an arc through that point)
1.1V: length 46.2
  Top Layer w0.2: v1(7.7,15.55) 7.69,15.55 7.68,15.56 ; C12.2 7.19,15.56 7.68,15.56 ; v1(11.7,15.55) 12,15.55 ; 7.68,15.56 U1.10 ; U1.51 21.16,15.56 21.5,15.9 C13.2 ; 16.7,18 16.7,17.9 ; 16.69,18.01 U1.65 16.69,20.68 16.31,21.06 16.31,21.91 16.62,22.22 16.84,22.22 ; C14.2 15.4,9 15.09,9.31 U1.32
  Top Layer w0.254: 16.84,22.22 16.84,22.78 16.13,23.49
  Top Layer w0.5: 11.9,15.45 11.9,13.44 ; 11.9,15.45 11.9,17.2 12.7,18 16.6,18 17.2,17.4 17.2,13.7 16.2,12.7 12.63,12.7 11.9,13.44 ; 11.9,15.45 11.87,15.42 11.87,13.47 11.9,13.44
  Bottom Layer w0.2: v1(11.7,15.55) v1(7.7,15.55) ; 15.1,9.3 v1(15.1,12.6) ; 21.2,15.6 21.16,15.56 v1(17.3,15.56)
  vias: v1(15.1,9.25) v1(21.19,15.61)
3.3V: length 160.1
  Top Layer w0.1: U1.69 U1.68
  Top Layer w0.2: U1.59 17.24,18.76 17.09,18.91 U1.64 17.09,20.71 16.84,20.96 16.84,21.25 ; U1.59 U1.60 ; U1.59 20.96,18.76 21,18.8 C11.2 ; 18.06,15.02 18.2,15.16 U1.50 21.14,15.16 21.2,15.1 C9.2 ; 13.89,11.97 U1.29 13.9,10.44 13.9,9.4 13.6,9.1 C5.2 ; 11,17.56 9.59,17.56 U1.5 7.19,17.56 C7.2 ; U1.68 15.49,20.87 13.5,22.86 C53.2 ; 11,13.54 10.98,13.56 U1.15 7.19,13.56 C6.2 ; U12.8 4.19,26.5 3.75,26.05 C52.2 ; H2.9 25.3,6.21 25.3,10.2 24.9,10.6 22.5,10.6 21.75,11.35 C8.2 21.71,11.56 U1.41 18.1,11.56 18.06,11.6 18.06,13.16 ; 12.15,21.2 12.15,20.85 12.29,20.71 U1.76 12.3,20.26 12.3,18.8 ; 11.9,12 11.89,11.99 U1.24 11.89,8.66 C4.2 ; 15.5,19.2 15.5,20.26
  Top Layer w0.4: 18.06,17.94 18.5,18.38 18.5,18.76 ; R1.1 19.65,20.45 18.5,19.3 v1(18.5,18.8)
  Top Layer w0.5: 1.2,26.08 1.2,18.6 2.6,17.2 2.6,6.9 3.3,6.2 8.7,6.2 11.15,8.65 C4.2 ; 1.2,26.08 1.2,31.7 1.8,32.3 22.5,32.3 22.9,31.9 U11.2 U11.4 22.9,21.1 22.25,20.45 21.74,20.45 ; 1.2,26.08 1.23,26.05 C52.2 ; v1(15.9,18.8) 15.5,19.2 15.1,18.8 12.3,18.8 11.06,17.56 11,17.56 11,12.9 11.99,11.91 16.81,11.91 ; 21.74,20.45 R1.1 ; 21.74,20.45 21.74,18.81 C11.2 ; v1(18.5,18.8) 18.53,18.77 18.53,18.76 ; 17.24,18.76 18.06,17.94 18.06,13.16 16.81,11.91 ; 16.81,11.91 16.8,11.9
  Bottom Layer w0.5: v1(15.9,18.8) v1(18.5,18.8)
GND: length 50
  Top Layer w0.1: SW2.3 v1(20.9,2.3) ; SW1.4 v1(6.4,3.45) ; C6.1 v1(5.5,13.6) ; C4.1 v1(11.9,7) ; v1(16.4,3.8) 16.4,4.56 16.21,4.56 15.9,4.25 U2.2 15,3.4 14.6,3 ; v1(16.48,15.36) 15.03,15.36 ; 15.03,15.36 U1.81 ; 15.03,15.36 v1(16.48,16.81) ; 14.49,14.99 14.49,14.91 14.5,14.9 ; 14.49,14.99 v1(12.9,13.4) ; 14.49,14.99 U1.81 ; U1.81 14.49,15.73 ; U1.81 14.5,15.35 14.5,14.9 ; U1.81 13.96,15.36 ; 14.49,15.73 v1(12.9,17.32) ; 14.49,15.73 14.49,15.81 ; C7.1 v1(5.5,17.6) ; v1(16,13.4) 14.5,14.9 ; 14.5,14.9 v1(14.5,13.4) ; v1(16.48,13.89) 15.01,15.36 ; C11.1 v1(23.4,18.8) ; 13.95,15.36 13.96,15.36 ; 13.95,15.36 v1(12.5,15.36) ; 13.95,15.36 v1(12.5,16.81) ; 13.96,15.36 v1(12.5,13.9) ; C13.1 v1(23.4,15.9) ; C12.1 v1(5.5,15.6) ; R43.1 v1(16.8,25.1) ; 11.05,21.2 v1(11.4,21.2) ; C16.1 14.6,3 ; 14.6,3 v1(15.1,3) ; R42.1 v1(11.47,24.6) ; C9.1 v1(23.4,15.1) ; SW2.4 v1(20.9,8.3) ; U2.4 v1(11.8,5.95) ; 14.49,15.81 v1(14.49,17.32) ; 14.49,15.81 v1(16,17.32) ; C53.1 v1(13.5,24.7) ; C8.1 v1(23.4,11.6) ; LED1.2 v1(23.7,13.3) ; SW1.3 v1(2,3.45) ; C52.1 v1(3,25.4) ; C5.1 13.6,7 ; U12.4 v1(8,23.4) ; C14.1 15.4,7
  Top Layer w0.2: 17.94,21.5 17.9,21.45 17.9,20.28 U1.62 v1(17.89,19.5)
  Top Layer w0.254: 18.75,21.5 17.94,21.5 17.94,22.2
  Top Layer w0.4: USB1.1 17.85,26.67 USB1.13 ; USB1.14 10.35,26.67 USB1.12
  vias: v1(13.6,7) v1(15.4,7) v1(18.4,21.97) v1(18.7,22.44) v1(19.06,21.97) v1(25.6,31.41) v1(25.6,30.93) v1(25.6,30.29) v1(25.6,29.8) v1(26.2,29.06) v1(26.2,28.3) v1(26.2,27.65) v1(26.2,26.9)
VBUS: length 15.3
  Top Layer w0.4: 16.9,28.3 13.31,28.3 11.65,26.65 ; 16.9,28.3 19.9,28.3 20.23,27.97 U11.3 20.8,28.17 20.8,29.1 21.5,29.8 21.5,30.6 ; 16.9,28.3 16.29,27.69 16.29,26.9 16.5,26.69 USB1.2
QSPI_CK: length 17.6
  Top Layer w0.1: U1.71 14.29,21.11 12.79,22.61 9.37,22.61 8.9,23.08 8.9,24.4 8.6,24.7 8.6,30.1 8.3,30.4 6.9,30.4 6.74,30.23 6.74,28.93
QSPI_D0: length 13.1
  Top Layer w0.1: U12.5 8,28.92 8,25 8.7,24.3 8.7,23 9.29,22.41 12.71,22.41 13.89,21.22 U1.72
QSPI_D1: length 11.1
  Top Layer w0.1: U12.2 5.47,20.56 5.7,20.33 8.63,20.33 10.3,22 12.54,22 13.09,21.45 U1.74
QSPI_D2: length 10.1
  Top Layer w0.1: U1.73 13.5,20.28 13.5,21.33 12.62,22.21 10.22,22.21 8.55,20.53 6.9,20.53 6.74,20.7 6.74,21.87
QSPI_D3: length 19.3
  Top Layer w0.1: U1.70 14.69,21 12.88,22.81 9.46,22.81 9.1,23.16 9.1,24.5 8.8,24.8 8.8,30.18 8.38,30.6 5.8,30.6 5.47,30.27 U12.7
QSPI_SS: length 13.3
  Top Layer w0.1: 4.2,20.5 4.2,21.86 U12.1 ; 4.2,20.5 4.57,20.13 8.73,20.13 10.4,21.8 11.51,21.8 11.51,21.8 12.46,21.8 12.69,21.57 U1.75 ; 4.2,20.5 4.2,19.33
RUN: length 5.5
  Top Layer w0.1: U1.35 16.29,9.51 16.5,9.3 19.8,9.3 20.03,9.07 R45.2
SWCLK: length 11.9
  Top Layer w0.1: U1.33 15.49,9.43 15.95,8.97 15.95,7.75 16.8,6.9 20.2,6.9 23.24,3.86 23.3,3.86
SWDIO: length 11.4
  Top Layer w0.1: U1.34 15.89,9.99 15.9,9.98 15.9,9.33 16.15,9.08 16.15,7.9 16.92,7.12 21.98,7.12 H1.3
USB_D+: length 4
  Top Layer w0.1: R3.2 14.35,24.08 14.35,25.04 ; 14.35,25.04 14.09,25.3 13.5,25.3 13.35,25.45 USB1.8 ; 14.35,25.04 USB1.6
USB_D-: length 4.7
  Top Layer w0.1: USB1.7 13.9,26.17 13.9,26.9 14,27 14.7,27 14.85,26.85 USB1.5 14.85,24.75 15,24.6 R2.2
VREG_LX: length 3.4
  Top Layer w0.2: 18.13,23.19 17.89,23.19 17.4,22.7 17.4,20.9 17.49,20.81 U1.63
$2N709: length 3.4
  Top Layer w0.2: U1.61 18.29,20.79 18.45,20.95 19.7,20.95 19.85,21.1 C3.2 20.55,21.5 R1.2
$2N1372: length 3.4
  Top Layer w0.1: 15,23.17 15,22 16.29,20.71 U1.66
$2N1378: length 3.6
  Top Layer w0.1: 14.3,23.17 14.3,22.41 15.89,20.82 U1.67
$2N1715: length 3.4
  Top Layer w0.1: 14.6,7.67 14.6,7.1 15,6.7 U2.3 15.65,5.95 16,5.6 16.35,5.6 C15.2
$2N1721: length 8.3
  Top Layer w0.1: U1.30 14.29,9.39 14.1,9.2 14.1,9.01 14.1,9.01 14.1,7.19 14.1,7.19 14.1,7.1 14,7 14,5.45 U2.1 12.8,3.8 13.35,3.25 C16.2
$2N1841: length 2
  Top Layer w0.1: U1.31 14.69,9.29 14.6,9.2 R4.2
$2N2034: length 1.1
  Top Layer w0.1: USB1.4 15.35,25.55 15.47,25.43 R43.2
$2N2035: length 1
  Top Layer w0.1: R42.2 12.35,25.12 USB1.10
$2N2585: length 13.6
  Top Layer w0.1: R44.1 4.2,17.3 4.5,17 4.5,8.16 5.51,7.15 SW1.2
$2N2753: length 1.4
  Top Layer w0.1: SW2.2 18.4,8.3 18.5,8.4 R45.1
$2N2964: length 2.3
  Top Layer w0.1: R46.2 20.98,12.28 20.66,11.96 U1.42
$2N3014: length 1.6
  Top Layer w0.1: R46.1 21.37,13.73 21.8,13.3 LED1.1
$2N3106: length 13.3
  Top Layer w0.1: U1.58 20.54,18.36 20.7,18.2 25.9,18.2 26.2,18.5 26.2,22.83 H2.1
$2N3110: length 11
  Top Layer w0.1: U1.57 26.06,17.96 26.4,18.3 26.4,20.49 H2.2
$2N3115: length 8.9
  Top Layer w0.1: H2.3 26.01,17.56 U1.56
$2N3120: length 8.5
  Top Layer w0.1: U1.55 20.9,17.16 20.95,17.21 27,17.21 H2.4
$2N3125: length 9.5
  Top Layer w0.1: U1.54 20.79,16.76 21.03,17 24.67,17 H2.5
$2N3130: length 11.9
  Top Layer w0.1: H2.6 26.4,12.73 26.4,14.98 24.58,16.8 21.12,16.8 20.67,16.36 U1.53
$2N3135: length 14.3
  Top Layer w0.1: U1.52 20.56,15.96 21.2,16.6 24.5,16.6 26.2,14.9 26.2,12.73 arc(26.2,12.72) 26.2,12.7 26.2,10.39 H2.7
$2N3140: length 14.9
  Top Layer w0.1: H2.8 26,8.05 26,13.6 25.1,14.5 20.6,14.5 20.34,14.76 U1.49

## Copper pours and planes (outline as drawn; the poured copper is in the pictures)
GND on Top Layer: 18,22.7 19.3,22.7 19.3,21.18 18,21.18
GND on Top Layer: 24.7,31.8 26.7,31.8 26.7,26.7 24.7,26.7
GND on Bottom Layer: 0,33 29,33 29,0 0,0

## Text on the board
Bottom Silkscreen Layer: RP2350 test PCB / (c) David Knell 2025 / https://github.com/daveknell/
Top Silkscreen Layer: BOOT | RUN
